# EAGLE design megaRF-mini-2.4.1 (EAGLE 6.2)
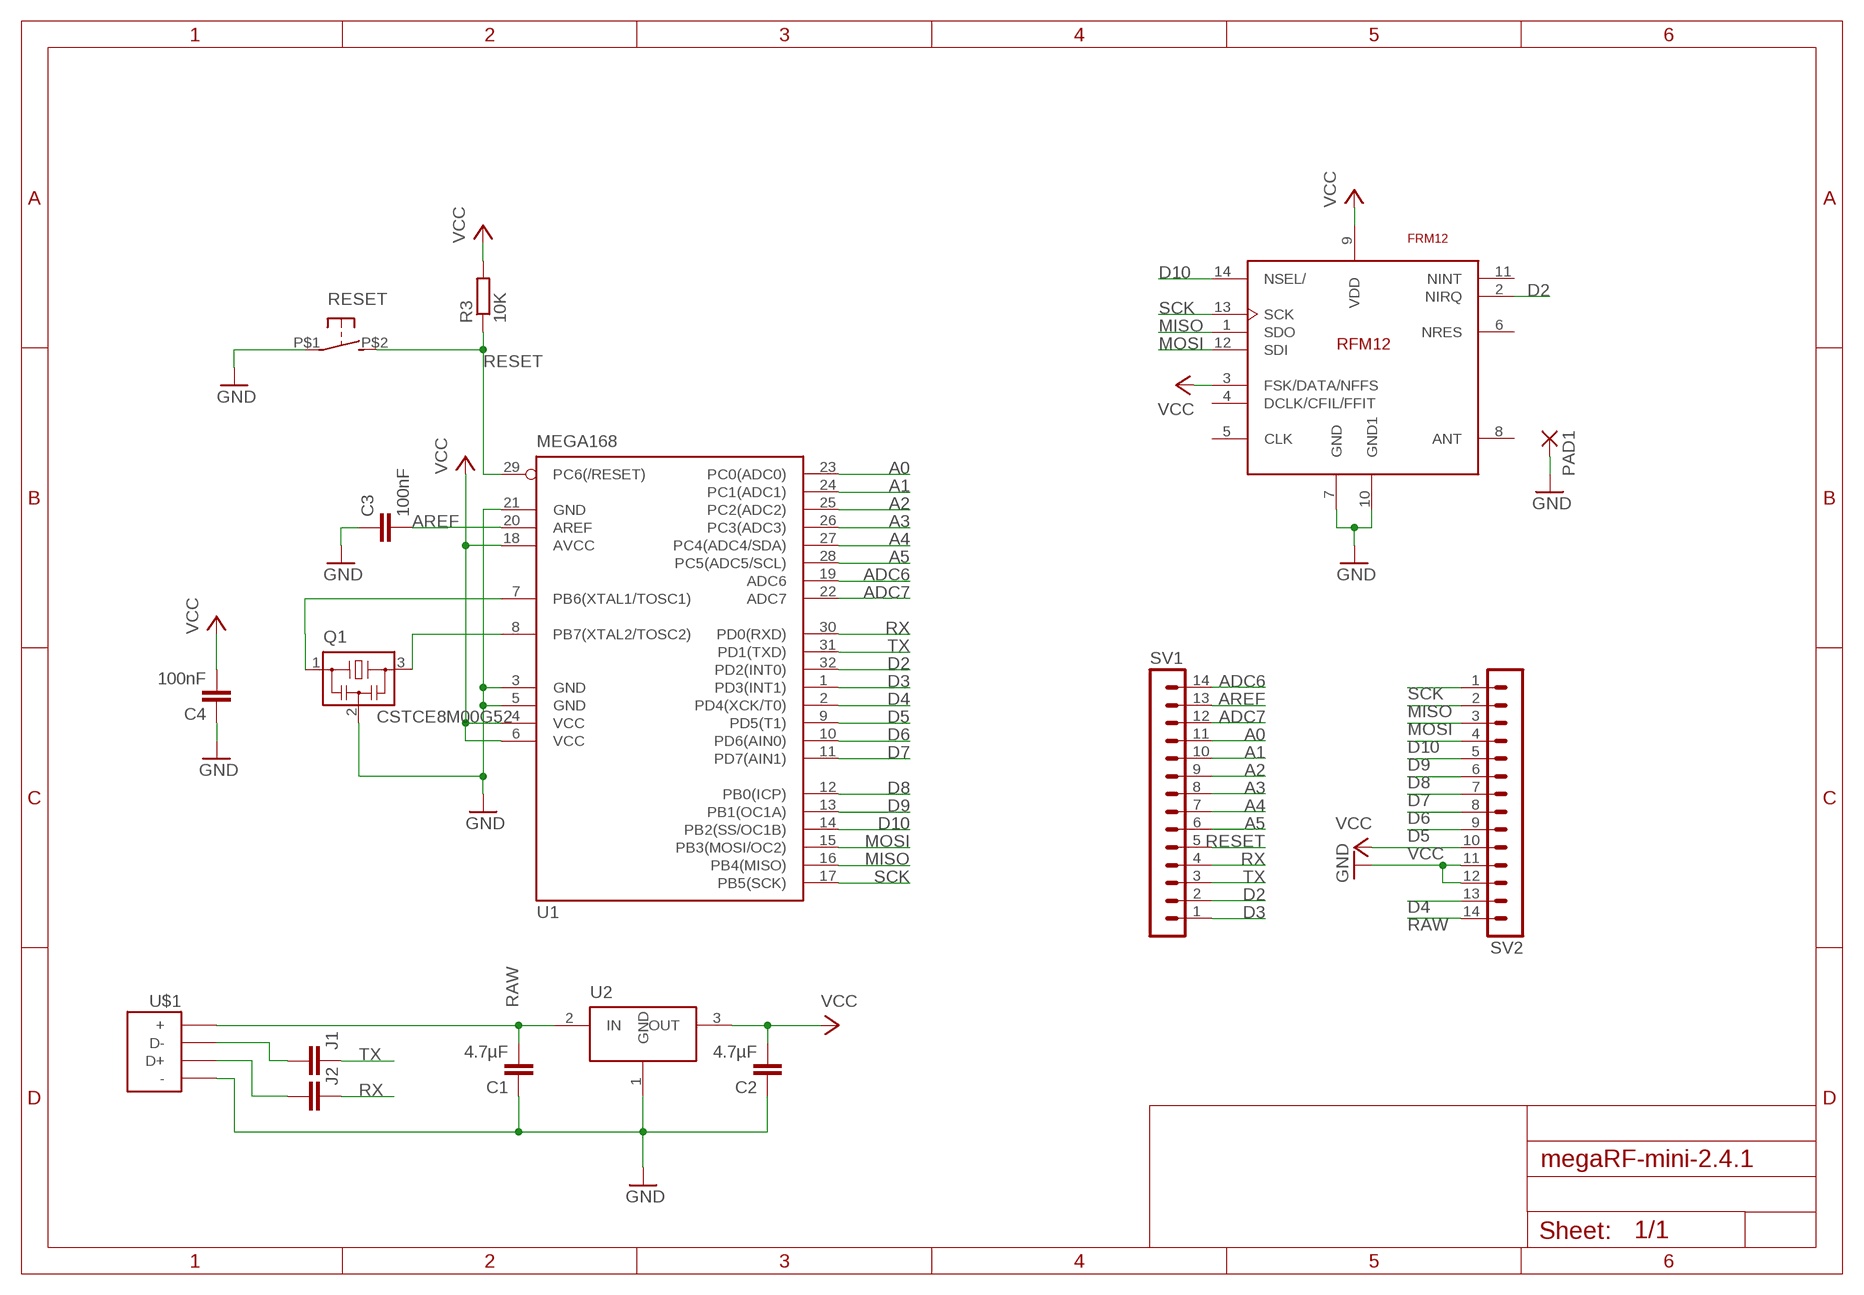
[diagram p0: schematic, sheet 1]

## Parts
C1  4.7µF  C-EUC0805  [C0805]
C2  4.7µF  C-EUC0805  [C0805]
C3  100nF  C-EUC0603K  [C0603K]
C4  100nF  C-EUC0603K  [C0603K]
J1  C-EUC0402  [C0402]
J2  C-EUC0402  [C0402]
PAD1  SMD2  [SMD1,27-2,54]
Q1  CSTCE8M00G52  [CSTCE8M00G52]
R3  10K  R-EU_R0603  [R0603]
RESET  DTSM-3  [DTSM31N]
RFM12  FRM12  [RFM12]
SV1  MA14-1  [MA14-1]
SV2  MA14-1  [MA14-1]
U1  MEGA168  MEGA8-AI  [TQFP32-08]
U2  TS1117CP33  [TO252]
U$1  USB-MICRO-B-RS  [USB-MICRO-B-RS]

## Nets
A0: SV1.11 U1.23(PC0(ADC0))
A1: SV1.10 U1.24(PC1(ADC1))
A2: SV1.9 U1.25(PC2(ADC2))
A3: SV1.8 U1.26(PC3(ADC3))
A4: SV1.7 U1.27(PC4(ADC4/SDA))
A5: SV1.6 U1.28(PC5(ADC5/SCL))
ADC6: SV1.14 U1.19(ADC6)
ADC7: SV1.12 U1.22(ADC7)
AREF: C3.2 SV1.13 U1.20(AREF)
D2: RFM12.2(NIRQ) SV1.2 U1.32(PD2(INT0))
D3: SV1.1 U1.1(PD3(INT1))
D4: SV2.13 U1.2(PD4(XCK/T0))
D5: SV2.9 U1.9(PD5(T1))
D6: SV2.8 U1.10(PD6(AIN0))
D7: SV2.7 U1.11(PD7(AIN1))
D8: SV2.6 U1.12(PB0(ICP))
D9: SV2.5 U1.13(PB1(OC1A))
D10: RFM12.14(NSEL/) SV2.4 U1.14(PB2(SS/OC1B))
GND: C1.1 C2.1 C3.1 C4.1 PAD1.1(P) Q1.2 RESET.P$1(P) RFM12.7(GND) RFM12.10(GND1) SV2.11 SV2.12 U1.3(GND) U1.5(GND) U1.21(GND) U2.1(GND) U$1.P$5(-)
MISO: RFM12.1(SDO) SV2.2 U1.16(PB4(MISO))
MOSI: RFM12.12(SDI) SV2.3 U1.15(PB3(MOSI/OC2))
N$1: J2.1 U$1.P$3(D+)
N$2: J1.2 U$1.P$2(D-)
N$5: Q1.1 U1.7(PB6(XTAL1/TOSC1))
N$6: Q1.3 U1.8(PB7(XTAL2/TOSC2))
RAW: C1.2 SV2.14 U2.2(IN) U$1.P$1(+)
RESET: R3.1 RESET.P$2(S) SV1.5 U1.29(PC6(/RESET))
RX: J2.2 SV1.4 U1.30(PD0(RXD))
SCK: RFM12.13(SCK) SV2.1 U1.17(PB5(SCK))
TX: J1.1 SV1.3 U1.31(PD1(TXD))
VCC: C2.2 C4.2 R3.2 RFM12.3(FSK/DATA/NFFS) RFM12.9(VDD) SV2.10 U1.4(VCC) U1.6(VCC) U1.18(AVCC) U2.3(OUT)
Unconnected: RFM12.4(DCLK/CFIL/FFIT) RFM12.5(CLK) RFM12.6(NRES) RFM12.8(ANT) RFM12.11(NINT)

## Library data of the parts
C1-C4 J1 J2 = resistor:C-EU: CAPACITOR, European symbol
PAD1 = wirepad:SMD2: SMD PAD
Q1 = diverses:CSTCE8M00G52
R3 = resistor:R-EU_: RESISTOR, European symbol
RESET = newlib:DTSM-3
RFM12 = megaRF:FRM12
SV1 SV2 = diverses:MA14-1: PIN HEADER; OC_FARNELL: unknown; OC_NEWARK: unknown
U1 = diverses:MEGA8: MICROCONTROLLER 8 Kbytes FLASH, 1 kbytes SRAM, 512 bytes EEPROM, USART, 6-channel 10 bit ADC, 2-channel 8 bit ADC Pin compatible with Atmega48, ATMega88, ATMega168 Source: avr.lbr; MPN: ATMEGA8-16AU; OC_FARNELL: 9171371; OC_NEWARK: 73M8863
U2 = diverses:TS1117CP33
U$1 = diverses:USB-MICRO-B-RS

## Board
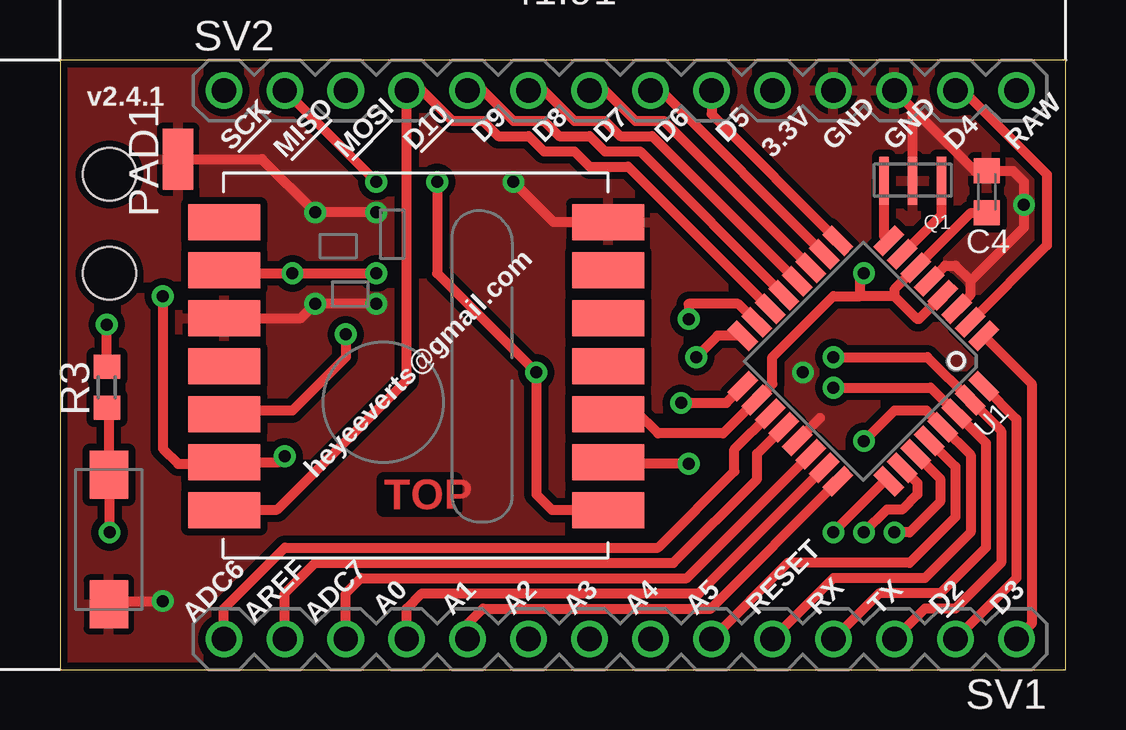
[diagram p1: board, top side]
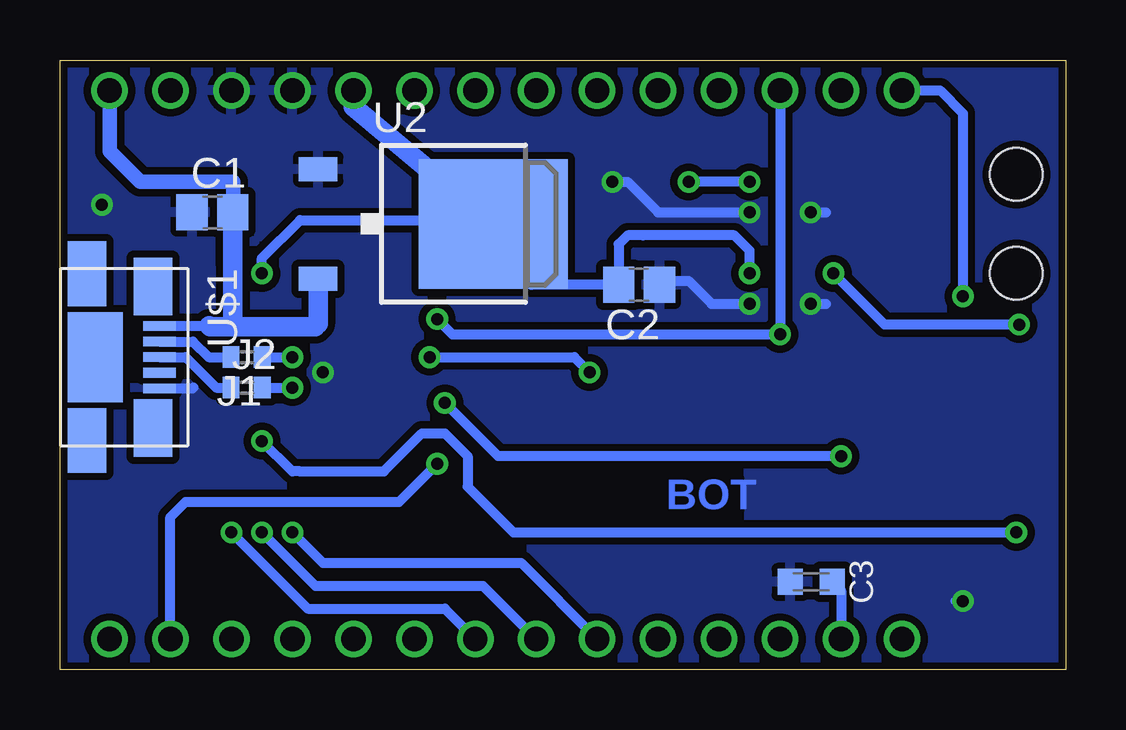
[diagram p2: board, bottom side, seen from below]

Size 41.91 x 25.4 mm. Coordinates in mm from the lower left corner, seen from the top.
Outline: 0,0 41.91,0 41.91,25.4 0,25.4 0,0
Copper layers (1*16): Top 0.035mm / dielectric 1.5mm / Bottom 0.035mm
Design rules: minimum track width 10mil, minimum drill 0.3mm, track to track 8mil, track to pad 8mil, pad to pad 8mil, via to via 8mil, smd to smd 8mil, copper to edge 8mil, drill to drill 0.4mm, minimum pad ring 10mil, minimum via ring 8mil, stop-mask expansion 4mil, vias tented up to drill 24mil, thermal gap 10mil
Holes 2.2 mm at 2.06,20.64 2.06,16.51

### Footprints (pad centres in the part's own frame; a part is rotated, then mirrored left to right if it is on the bottom)
C0805 = smd 1.3 x 1.5: 1 -0.85,0; 2 0.85,0
C0603K = smd 1.05 x 1.08: 1 -0.875,0; 2 0.875,0
C0402 = smd 0.7 x 0.9: 1 -0.65,0; 2 0.65,0
SMD1,27-2,54 = smd 1.27 x 2.54: 1 0,0
CSTCE8M00G52 = smd 0.4 x 2: 1 -1.2,0; 2 0,0; 3 1.2,0
R0603 = smd 1 x 1.1: 1 -0.85,0; 2 0.85,0
DTSM31N = smd 2 x 1.6: P$1 0,0; P$2 5.4,0
RFM12 = smd 1.5 x 3: 1 -5,-10; 2 -3,-10; 3 -1,-10; 4 1,-10; 5 3,-10; 6 5,-10; 7 7,-10; 8 7,6; 9 5,6; 10 3,6; 11 1,6; 12 -1,6; 13 -3,6; 14 -5,6
MA14-1 = drill 1.016: 1 -24.13,0; 2 -21.59,0; 3 -19.05,0; 4 -16.51,0; 5 -13.97,0; 6 -11.43,0; 7 -8.89,0; 8 -6.35,0; 9 -3.81,0; 10 -1.27,0; 11 1.27,0; 12 3.81,0; 13 6.35,0; 14 8.89,0
TQFP32-08 = smd 1.27 x 0.559: 1 -4.293,2.8; 2 -4.293,2; 3 -4.293,1.2; 4 -4.293,0.4; 5 -4.293,-0.4; 6 -4.293,-1.2; 7 -4.293,-2; 8 -4.293,-2.8; 17 4.293,-2.8; 18 4.293,-2; 19 4.293,-1.2; 20 4.293,-0.4; 21 4.293,0.4; 22 4.293,1.2; 23 4.293,2; 24 4.293,2.8 | smd 0.559 x 1.27: 9 -2.8,-4.293; 10 -2,-4.293; 11 -1.2,-4.293; 12 -0.4,-4.293; 13 0.4,-4.293; 14 1.2,-4.293; 15 2,-4.293; 16 2.8,-4.293; 25 2.8,4.293; 26 2,4.293; 27 1.2,4.293; 28 0.4,4.293; 29 -0.4,4.293; 30 -1.2,4.293; 31 -2,4.293; 32 -2.8,4.293
TO252 = smd 1 x 1.6: 1 -2.28,-4.8; 2 2.28,-4.8 | smd 5.4 x 6.2: 3 0,2.5
USB-MICRO-B-RS = smd 0.4 x 1.35: P$1 -1.3,3.825; P$2 -0.65,3.825; P$3 0,3.825; P$4 0.65,3.825; P$5 1.3,3.825 | smd 2.4 x 1.6: P$6 -2.95,3.55; P$10 2.95,3.55 | smd 2.7 x 1.6: P$7 -3.475,0.8; P$9 3.475,0.8 | smd 3.75 x 2.3: P$8 0,1.15

### Placement (x,y rotation side)
C1  35.56,19.05 0 bottom
C2  17.78,16.03 180 bottom
C3  10.61,3.66 0 bottom
C4  38.61,19.91 270 top
J1  34.13,13.02 180 bottom
J2  34.13,11.75 0 bottom
PAD1  4.92,21.27 0 top
Q1  35.53,20.37 180 top
R3  1.96,11.76 90 top
RESET  2.03,2.72 90 top
RFM12  12.84,11.64 90 top
SV1  15.72,1.27 180 top
SV2  30.96,24.13 0 top
U1  33.47,12.86 225 top
U2  26.35,18.57 270 bottom
U$1  41.59,13.02 270 bottom

### Tracks (layer width: path | path; a pad name or v marks a point on that pad's centre or on a via)
A0
  Top 0.406: SV1.11 14.45,2.54 15.08,3.17 26.62,3.17 U1.23
A1
  Top 0.406: SV1.10 16.99,1.91 17.62,2.54 27.12,2.54 U1.24
A2  (via drill 0.5)
  Top 0.406: U1.25 34.35,7.84 v32.23,5.72
  Bottom 0.406: v32.23,5.72 30.96,4.45 22.7,4.45 SV1.9
A3  (via drill 0.5)
  Top 0.406: U1.26 35.72,7.78 35.72,7.3 35.08,6.67 34.45,6.67 v33.5,5.72
  Bottom 0.406: v33.5,5.72 31.27,3.49 24.29,3.49 SV1.8
A4  (via drill 0.5)
  Top 0.406: U1.27 36.67,7.96 36.67,6.99 35.4,5.72 v34.77,5.72
  Bottom 0.406: v34.77,5.72 31.59,2.54 25.88,2.54 SV1.7
A5
  Top 0.406: U1.28 37.31,8.45 37.31,6.35 35.4,4.45 30.32,4.45 SV1.6
ADC6
  Top 0.406: SV1.14 6.83,2.54 9.37,5.08 24.92,5.08 28.1,8.25 28.1,9.18 U1.19
ADC7
  Top 0.406: SV1.12 11.91,3.17 12.54,3.81 26.12,3.81 U1.22
AREF
  Top 0.406: SV1.13 9.37,3.17 10.64,4.45 24.5,4.45 25.56,4.45 29.05,7.94 29.05,8.89 29.05,9 U1.20
  Bottom 0.406: C3.2 9.37,3.29 SV1.13
D2  (via drill 0.5)
  Top 0.406: U1.32 39.85,10.44 39.85,3.81 SV1.2 | v26.19,8.57 22.9,8.57 RFM12.2
  Bottom 0.406: SV1.2 37.31,6.35 36.67,6.99 27.78,6.99 v26.19,8.57
D3
  Top 0.406: U1.1 39.85,12.55 40.48,11.92 40.48,1.91 SV1.1
D4
  Top 0.406: SV2.13 37.62,24.13 41.12,20.64 41.12,17.67 U1.2
D5
  Top 0.406: SV2.9 27.15,23.14 U1.9
D6
  Top 0.406: SV2.8 25.02,24.13 U1.10
D7
  Top 0.406: SV2.7 22.7,24.13 23.97,22.86 25.16,22.86 U1.11
D8
  Top 0.406: SV2.6 20.16,24.13 21.43,22.86 22.7,22.86 23.34,22.23 24.67,22.23 U1.12
D9
  Top 0.406: SV2.5 17.62,24.13 18.89,22.86 20.16,22.86 20.8,22.23 22.07,22.23 22.7,21.59 24.17,21.59 U1.13
D10
  Top 0.406: U1.14 23.67,20.96 22.07,20.96 21.43,21.59 20.16,21.59 19.53,22.23 18.26,22.23 17.62,22.86 16.35,22.86 15.08,24.13 SV2.4 14.45,12.07 9.05,6.67 6.86,6.67 RFM12.14
GND  (via drill 0.5)
  Top 0.406: Q1.2 35.53,23.37 | 35.53,23.37 SV2.12 | U1.21 31.66,10.48 | U1.5 36.88,16.83 37.31,16.83 37.94,16.19 | U1.3 37.94,15.63 37.94,16.19 | 35.53,23.37 38.11,20.79 C4.1 39.7,20.79 40.16,20.32 40.16,18.41 37.94,16.19 | v13.18,15.24 v10.64,15.24 10.04,14.64 RFM12.10 | RFM12.7 20.57,18.64 v18.89,20.32 | RESET.P$1 2.17,2.86 v4.29,2.86 | v13.18,19.05 v10.64,19.05 8.41,21.27 PAD1.1
  Bottom 0.406: C2.1 16.77,16.19 15.72,16.19 14.76,15.24 v13.18,15.24 | v10.64,15.24 10,15.24 | v18.89,20.32 18.26,20.32 16.99,19.05 v13.18,19.05 | v4.29,2.86 4.6,2.86 | v10.64,19.05 10,19.05 | U$1.P$5 36.38,11.72 36.35,11.75
  other vias: 30.96,12.38 40.16,19.37
  pour Bottom (isolate 0.305): 42.39,25.72 42.39,-0.64 -0.48,-0.64 -0.48,26.04
  pour Top (isolate 0.305): -0.48,26.04 42.39,25.72 42.39,-0.64 -0.48,-0.64
MISO  (via drill 0.5)
  Top 0.406: RFM12.1 20.51,6.64 20.16,6.99 19.84,7.3 v19.84,12.38 15.72,16.51 v15.72,20.32 | U1.16 27.4,13.91 v26.51,13.02 | SV2.2 v13.18,20.32
  Bottom 0.406: v26.51,13.02 20.48,13.02 v19.84,12.38 | v13.18,20.32 v15.72,20.32
MOSI  (via drill 0.5)
  Top 0.406: v11.91,13.97 11.91,13.02 9.68,10.8 6.99,10.8 RFM12.12 | U1.15 28.26,15.24 26.19,15.24 v26.19,14.61
  Bottom 0.406: v26.19,14.61 25.56,13.97 v11.91,13.97 SV2.3
N$1
  Bottom 0.406: U$1.P$3 36.67,13.02 35.4,11.75 J2.1
N$2
  Bottom 0.406: U$1.P$2 36.37,13.67 35.72,13.02 J1.2
N$5
  Top 0.406: Q1.1 36.73,18.94 U1.7
N$6
  Top 0.406: Q1.3 34.33,18.07 U1.8
RAW
  Bottom 0.406: U$1.P$1 35.69,14.32 | 34.67,19.03 C1.2
  Bottom 0.61: C1.2 34.69,20.32 38.58,20.32 39.85,21.59 SV2.14
  Bottom 0.813: C1.2 34.71,16.82 34.71,15.3 34.71,14.34 34.77,14.29 | U2.2 31.15,14.41 31.27,14.29 34.77,14.29 | 34.77,14.29 35.66,14.29 35.69,14.32
RESET  (via drill 0.5)
  Top 0.406: SV1.5 32.23,3.81 36.04,3.81 37.94,5.72 37.94,8.95 U1.29 36.1,10.8 35.08,10.8 34.77,10.8 v33.5,9.52 | R3.1 2.03,10.83 RESET.P$2 2.06,8.12 v2.06,5.72
  Bottom 0.406: v2.06,5.72 20.48,5.72 23.02,5.72 24.92,7.62 24.92,8.89 25.88,9.84 26.19,9.84 26.83,9.84 28.42,8.25 31.91,8.25 32.23,8.25 v33.5,9.52
RX  (via drill 0.5)
  Top 0.406: SV1.4 34.13,3.17 36.67,3.17 38.58,5.08 38.58,9.45 U1.30 36.28,11.75 v32.23,11.75
  Bottom 0.406: J2.2 v32.23,11.75
SCK  (via drill 0.5)
  Top 0.406: v9.37,8.89 9.12,8.64 RFM12.13 6.77,8.57 4.92,8.57 4.29,9.21 v4.29,15.56 | v25.88,11.11 27.77,11.11 U1.17
  Bottom 0.406: v9.37,8.89 23.65,8.89 v25.88,11.11 | SV2.1 5.24,24.13 4.29,23.18 v4.29,15.56
TX  (via drill 0.5)
  Top 0.406: SV1.3 36.04,2.54 37.31,2.54 39.21,4.45 39.21,9.94 U1.31 36.14,13.02 v32.23,13.02
  Bottom 0.406: J1.1 v32.23,13.02
VCC  (via drill 0.5)
  Top 0.406: RFM12.3 23.49,10.64 23.97,10.8 24.92,9.84 27.63,9.84 U1.18 29.69,11.9 29.69,13.02 32.23,15.56 33.35,15.56 | 34.77,15.56 34.77,15.85 U1.6 37.95,19.04 C4.2 | U1.4 35.79,14.61 35.72,14.61 34.77,15.56 | 34.77,15.56 33.35,15.56 | RFM12.9 6.97,16.51 v9.68,16.51 | v9.68,16.51 10,16.51 | 10,16.51 v13.18,16.51 | R3.2 v1.96,14.38 v1.95,14.38 | v9.68,16.51 10,16.51 | 33.35,15.56 33.35,16.36 v33.5,16.51
  Bottom 0.406: v13.18,16.51 13.18,17.46 13.81,18.1 17.62,18.1 18.26,18.1 18.63,17.72 C2.2 22.27,16.03 U2.3 24.01,18.73 31.91,18.73 33.5,17.14 v33.5,16.51 | v1.95,14.38 7.55,14.38 v9.68,16.51
  Bottom 0.813: U2.3 29.69,23.46 SV2.10

### Text on the board
Top: TOP
Bottom: BOT
tPlace: v2.4.1 | SCK | MISO | MOSI | D10 | D9 | D8 | D7 | D6 | D5 | 3.3V | GND | GND | D4 | RAW | heyeeverts@gmail.com | A0 | A1 | A2 | A3 | A4 | A5 | RESET | RX | TX | D2 | D3 | ADC6 | AREF | ADC7